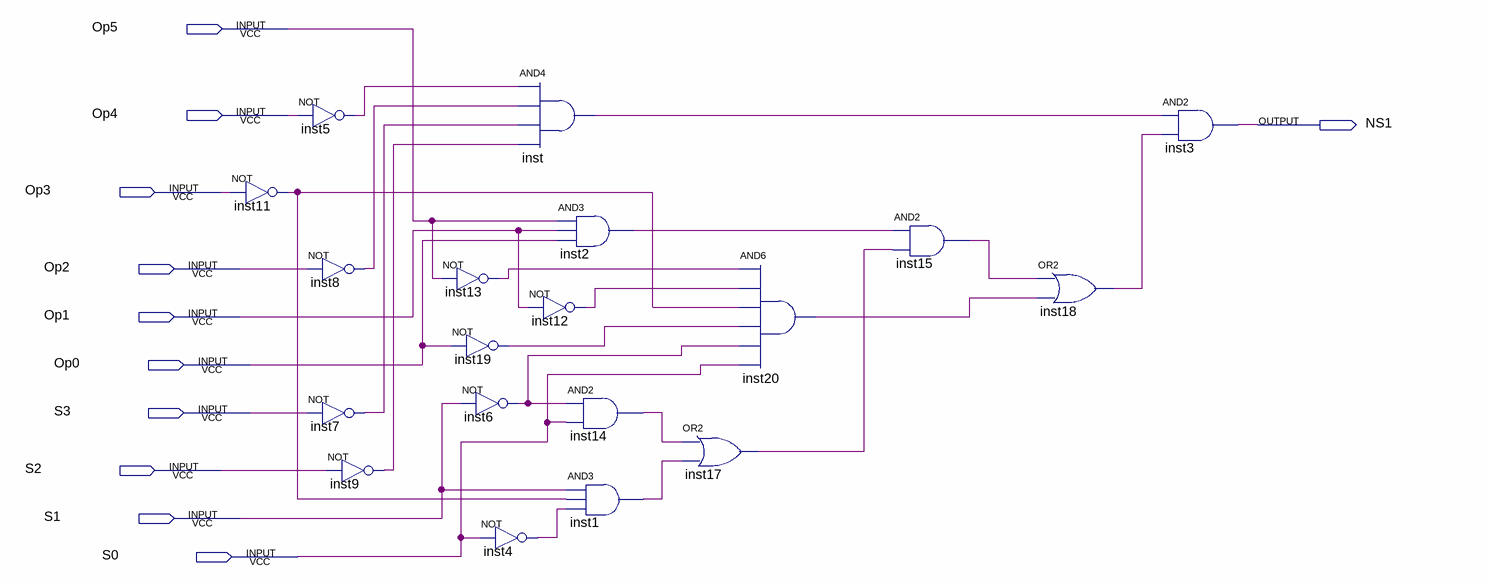
[diagram p0: schematic sheet]
// Quartus schematic NS1.bdf as structural Verilog: 19 symbols, 11 pins
module NS1 (
  input  Op5,
  input  Op4,
  input  Op3,
  input  Op2,
  input  Op1,
  input  Op0,
  input  S3,
  input  S2,
  input  S1,
  input  S0,
  output NS1
);

  wire inst1_out, inst2_out, inst4_out, inst5_out, inst6_out, inst7_out, inst8_out, inst9_out, inst11_out,
       inst12_out, inst13_out, inst14_out, inst15_out, inst17_out, inst18_out, inst19_out, inst20_out,
       inst_out;

  not inst11 (inst11_out, Op3);
  not inst5 (inst5_out, Op4);
  not inst8 (inst8_out, Op2);
  not inst7 (inst7_out, S3);
  not inst9 (inst9_out, S2);
  not inst13 (inst13_out, Op5);
  and inst (inst_out, inst5_out, inst8_out, inst7_out, inst9_out);
  not inst19 (inst19_out, Op0);
  not inst6 (inst6_out, S1);
  not inst4 (inst4_out, S0);
  and inst2 (inst2_out, Op5, Op1, Op0);
  not inst12 (inst12_out, Op1);
  and inst14 (inst14_out, inst6_out, S0);
  and inst1 (inst1_out, S1, inst11_out, inst4_out);
  and inst20 (inst20_out, inst13_out, inst12_out, inst11_out, inst19_out, inst6_out, S0);
  or inst17 (inst17_out, inst14_out, inst1_out);
  and inst15 (inst15_out, inst2_out, inst17_out);
  or inst18 (inst18_out, inst15_out, inst20_out);
  and inst3 (NS1, inst_out, inst18_out);
endmodule
